# EAGLE design solarWorldClock (EAGLE 6.6.0)
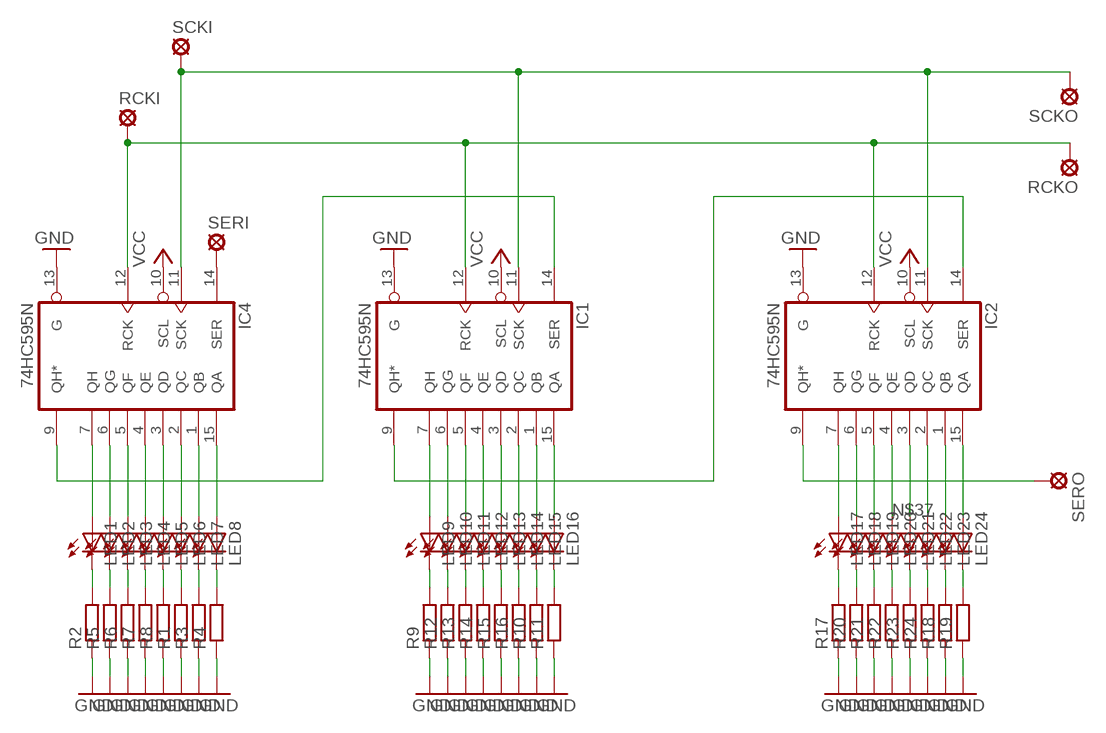
[diagram p0: schematic, sheet 1]

## Parts
IC1  74HC595N  [DIL16]
IC2  74HC595N  [DIL16]
IC4  74HC595N  [DIL16]
LED1  LEDLZR181  [LZR181]
LED2  LEDLZR181  [LZR181]
LED3  LEDLZR181  [LZR181]
LED4  LEDLZR181  [LZR181]
LED5  LEDLZR181  [LZR181]
LED6  LEDLZR181  [LZR181]
LED7  LEDLZR181  [LZR181]
LED8  LEDLZR181  [LZR181]
LED9  LEDLZR181  [LZR181]
LED10  LEDLZR181  [LZR181]
LED11  LEDLZR181  [LZR181]
LED12  LEDLZR181  [LZR181]
LED13  LEDLZR181  [LZR181]
LED14  LEDLZR181  [LZR181]
LED15  LEDLZR181  [LZR181]
LED16  LEDLZR181  [LZR181]
LED17  LEDLZR181  [LZR181]
LED18  LEDLZR181  [LZR181]
LED19  LEDLZR181  [LZR181]
LED20  LEDLZR181  [LZR181]
LED21  LEDLZR181  [LZR181]
LED22  LEDLZR181  [LZR181]
LED23  LEDLZR181  [LZR181]
LED24  LEDLZR181  [LZR181]
R1  R-EU_0207/7  [0207/7]
R2  R-EU_0207/7  [0207/7]
R3  R-EU_0207/7  [0207/7]
R4  R-EU_0207/7  [0207/7]
R5  R-EU_0207/7  [0207/7]
R6  R-EU_0207/7  [0207/7]
R7  R-EU_0207/7  [0207/7]
R8  R-EU_0207/7  [0207/7]
R9  R-EU_0207/7  [0207/7]
R10  R-EU_0207/7  [0207/7]
R11  R-EU_0207/7  [0207/7]
R12  R-EU_0207/7  [0207/7]
R13  R-EU_0207/7  [0207/7]
R14  R-EU_0207/7  [0207/7]
R15  R-EU_0207/7  [0207/7]
R16  R-EU_0207/7  [0207/7]
R17  R-EU_0207/7  [0207/7]
R18  R-EU_0207/7  [0207/7]
R19  R-EU_0207/7  [0207/7]
R20  R-EU_0207/7  [0207/7]
R21  R-EU_0207/7  [0207/7]
R22  R-EU_0207/7  [0207/7]
R23  R-EU_0207/7  [0207/7]
R24  R-EU_0207/7  [0207/7]
RCKI  LSP10  [LSP10]
RCKO  LSP10  [LSP10]
SCKI  LSP10  [LSP10]
SCKO  LSP10  [LSP10]
SERI  LSP10  [LSP10]
SERO  LSP10  [LSP10]

## Nets
GND: IC1.13(G) IC2.13(G) IC4.13(G) R1.1 R2.1 R3.1 R4.1 R5.1 R6.1 R7.1 R8.1 R9.1 R10.1 R11.1 R12.1 R13.1 R14.1 R15.1 R16.1 R17.1 R18.1 R19.1 R20.1 R21.1 R22.1 R23.1 R24.1
N$1: IC4.7(QH) LED1.A
N$2: LED1.K(C) R2.2
N$3: IC4.6(QG) LED2.A
N$4: IC4.5(QF) LED3.A
N$5: IC4.4(QE) LED4.A
N$6: IC4.3(QD) LED5.A
N$7: IC4.2(QC) LED6.A
N$8: IC4.1(QB) LED7.A
N$9: IC4.15(QA) LED8.A
N$10: LED2.K(C) R5.2
N$11: LED3.K(C) R6.2
N$12: LED4.K(C) R7.2
N$13: LED5.K(C) R8.2
N$14: LED6.K(C) R1.2
N$15: LED7.K(C) R3.2
N$16: LED8.K(C) R4.2
N$17: IC1.7(QH) LED9.A
N$18: IC1.6(QG) LED10.A
N$19: IC1.5(QF) LED11.A
N$20: IC1.4(QE) LED12.A
N$21: IC1.3(QD) LED13.A
N$22: IC1.2(QC) LED14.A
N$23: IC1.1(QB) LED15.A
N$24: IC1.15(QA) LED16.A
N$25: LED9.K(C) R9.2
N$26: LED10.K(C) R12.2
N$27: LED11.K(C) R13.2
N$28: LED12.K(C) R14.2
N$29: LED13.K(C) R15.2
N$30: LED14.K(C) R16.2
N$31: LED15.K(C) R10.2
N$32: LED16.K(C) R11.2
N$33: IC2.9(QH*) SERO.MP
N$34: IC1.14(SER) IC4.9(QH*)
N$35: IC2.7(QH) LED17.A
N$36: IC2.6(QG) LED18.A
N$37: IC2.5(QF) LED19.A
N$38: IC2.4(QE) LED20.A
N$39: IC2.3(QD) LED21.A
N$40: IC2.2(QC) LED22.A
N$41: IC2.1(QB) LED23.A
N$42: IC2.15(QA) LED24.A
N$43: LED17.K(C) R17.2
N$44: LED18.K(C) R20.2
N$45: LED19.K(C) R21.2
N$46: LED20.K(C) R22.2
N$47: LED21.K(C) R23.2
N$48: LED22.K(C) R24.2
N$49: LED23.K(C) R18.2
N$50: LED24.K(C) R19.2
N$51: IC1.9(QH*) IC2.14(SER)
N$52: IC1.12(RCK) IC2.12(RCK) IC4.12(RCK) RCKI.MP RCKO.MP
N$53: IC1.11(SCK) IC2.11(SCK) IC4.11(SCK) SCKI.MP SCKO.MP
N$54: IC4.14(SER) SERI.MP
VCC: IC1.10(SCL) IC2.10(SCL) IC4.10(SCL)

## Power pins joined to a net without a drawn wire
GND: IC1.8(GND) IC2.8(GND) IC4.8(GND)
VCC: IC1.16(VCC) IC2.16(VCC) IC4.16(VCC)

## Library data of the parts
IC1 IC2 IC4 = 74xx-eu:74*595: 8-bit SHIFT REGISTER, output latch
LED1-LED24 = led:LED: LED OSRAM: - CHIPLED LG R971, LG N971, LY N971, LG Q971, LY Q971, LO R971, LY R971 LH N974, LH R974 LS Q976, LO Q976, LY Q976 LO Q996 - Hyper CHIPLED LW Q18S LB Q993, LB Q99A, LB R99A - SideLED LS A670, LO A670, LY A670, LG A670, LP A670 LB A673, LV A673, LT A673, LW A673 LH A674 LY A675 LS A676, LA A676, LO A676, LY A676, LW A676 LS A679, LY A679, LG A679 - Hyper Micro SIDELED® LS Y876, LA Y876, LO Y876, LY Y876 LT Y87S - SmartLED LW L88C, LW L88S LB L89C, LB L89S, LG L890 LS L89K, LO L89K, LY L89K LS L896, LA L896, LO L896, LY L896 - TOPLED LS T670, LO T670, LY T670, LG T670, LP T670 LSG T670, LSP T670, LSY T670, LOP T670, LYG T670 LG T671, LOG T671, LSG T671 LB T673, LV T673, LT T673, LW T673 LH T674 LS T676, LA T676, LO T676, LY T676, LB T676, LH T676, LSB T676, LW T676 LB T67C, LV T67C, LT T67C, LS T67K, LO T67K, LY T67K, LW E67C LS E67B, LA E67B, LO E67B, LY E67B, LB E67C, LV E67C, LT E67C LW T67C LS T679, LY T679, LG T679 LS T770, LO T770, LY T770, LG T770, LP T770 LB T773, LV T773, LT T773, LW T773 LH T774 LS E675, LA E675, LY E675, LS T675 LS T776, LA T776, LO T776, LY T776, LB T776 LHGB T686 LT T68C, LB T68C - Hyper Mini TOPLED® LB M676 - Mini TOPLED Santana® LG M470 LS M47K, LO M47K, LY M47K Source: http://www.osram.convergy.de LUXEON: - LUMILED® LXK2-PW12-R00, LXK2-PW12-S00, LXK2-PW14-U00, LXK2-PW14-V00 LXK2-PM12-R00, LXK2-PM12-S00, LXK2-PM14-U00 LXK2-PE12-Q00, LXK2-PE12-R00, LXK2-PE12-S00, LXK2-PE14-T00, LXK2-PE14-U00 LXK2-PB12-K00, LXK2-PB12-L00, LXK2-PB12-M00, LXK2-PB14-N00, LXK2-PB14-P00, LXK2-PB14-Q00 LXK2-PR12-L00, LXK2-PR12-M00, LXK2-PR14-Q00, LXK2-PR14-R00 LXK2-PD12-Q00, LXK2-PD12-R00, LXK2-PD12-S00 LXK2-PH12-R00, LXK2-PH12-S00 LXK2-PL12-P00, LXK2-PL12-Q00, LXK2-PL12-R00 Source: www.luxeon.com KINGBRIGHT: KA-3528ASYC Source: www.kingbright.com
R1-R24 = rcl:R-EU_: RESISTOR, European symbol
RCKI RCKO SCKI SCKO SERI SERO = solpad:LSP10: SOLDER PAD drill 1.0 mm, distributor Buerklin, 12H555

## Board
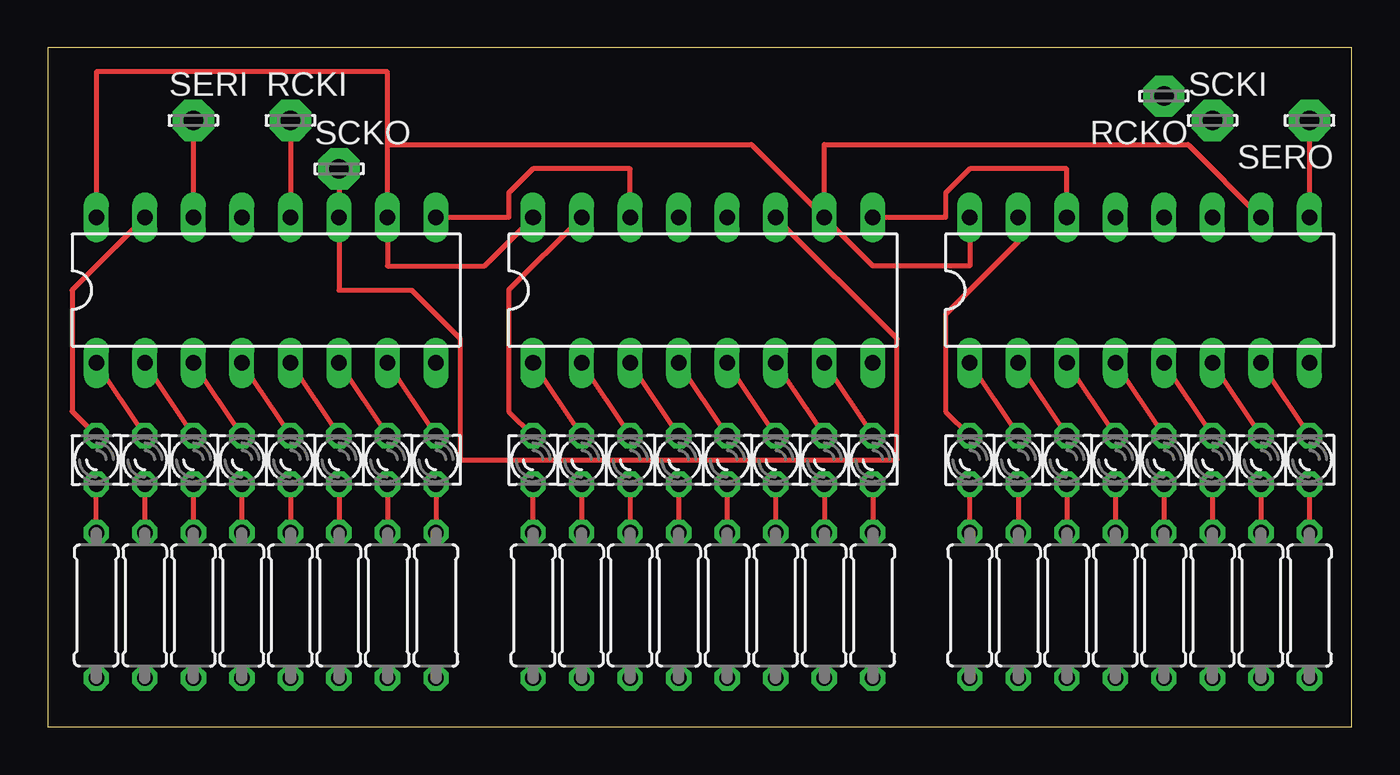
[diagram p1: board, top side]
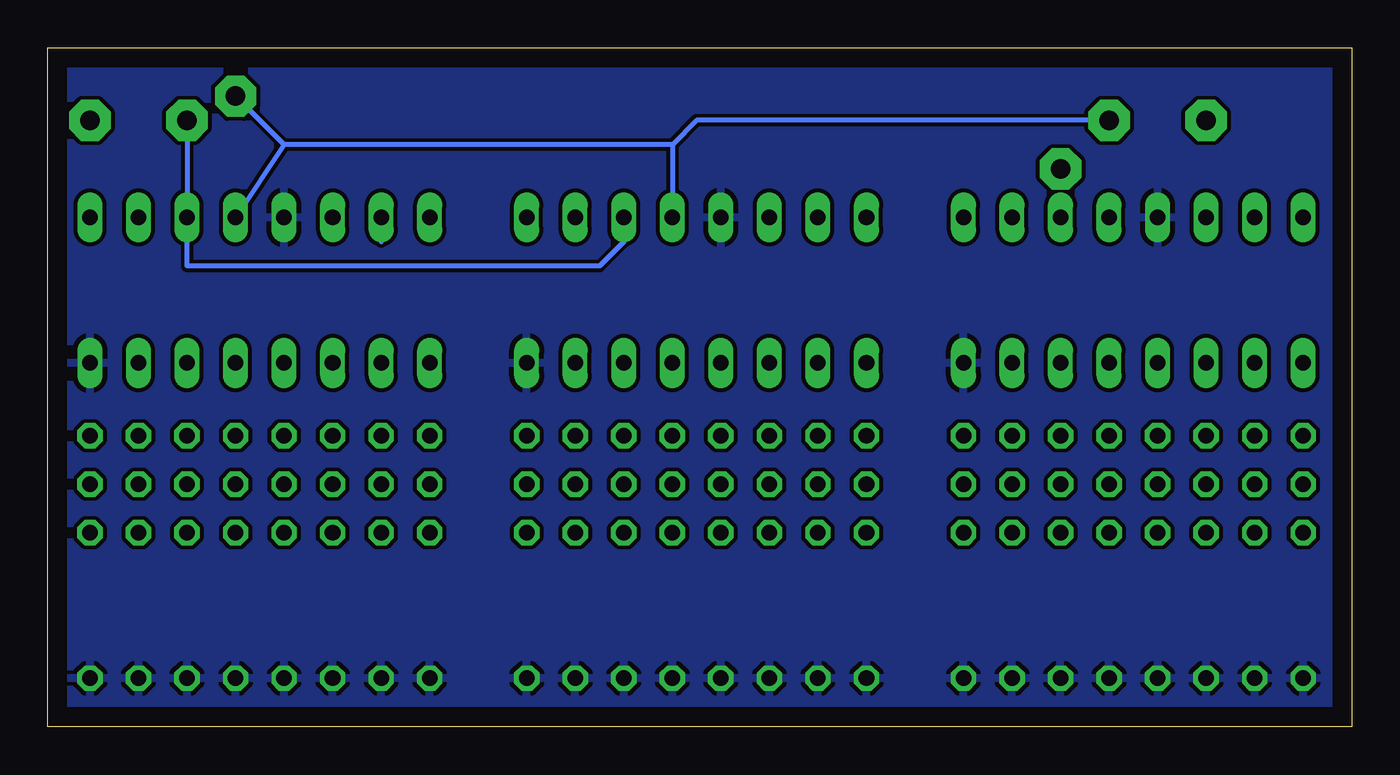
[diagram p2: board, bottom side, seen from below]

Size 68.25 x 35.55 mm. Coordinates in mm from the lower left corner, seen from the top.
Outline: 0,0 68.25,0 68.25,35.55 0,35.55 0,0
Copper layers (1*16): Top 0.035mm / dielectric 1.5mm / Bottom 0.035mm
Design rules "default": minimum track width 10mil, minimum drill 24mil, track to track 8mil, track to pad 8mil, pad to pad 8mil, via to via 8mil, smd to smd 8mil, copper to edge 40mil, drill to drill 8mil, minimum pad ring 10mil, minimum via ring 8mil, stop-mask expansion 4mil, vias tented up to drill 0mil, thermal gap 10mil

### Footprints (pad centres in the part's own frame; a part is rotated, then mirrored left to right if it is on the bottom)
DIL16 = drill 0.813 long: 1 -8.89,-3.81; 2 -6.35,-3.81; 3 -3.81,-3.81; 4 -1.27,-3.81; 5 1.27,-3.81; 6 3.81,-3.81; 7 6.35,-3.81; 8 8.89,-3.81; 9 8.89,3.81; 10 6.35,3.81; 11 3.81,3.81; 12 1.27,3.81; 13 -1.27,3.81; 14 -3.81,3.81; 15 -6.35,3.81; 16 -8.89,3.81
LZR181 = drill 0.813 octagon: A -1.27,0; K 1.27,0
0207/7 = drill 0.813 octagon: 1 -3.81,0; 2 3.81,0
LSP10 = drill 1.016 pad 2.159 octagon: MP 0,0

### Placement (x,y rotation side)
IC1  34.29,22.86 0 top
IC2  57.15,22.86 0 top
IC4  11.43,22.86 0 top
LED1  20.32,13.97 270 top
LED2  17.78,13.97 270 top
LED3  15.24,13.97 270 top
LED4  12.7,13.97 270 top
LED5  10.16,13.97 270 top
LED6  7.62,13.97 270 top
LED7  5.08,13.97 270 top
LED8  2.54,13.97 270 top
LED9  43.18,13.97 270 top
LED10  40.64,13.97 270 top
LED11  38.1,13.97 270 top
LED12  35.56,13.97 270 top
LED13  33.02,13.97 270 top
LED14  30.48,13.97 270 top
LED15  27.94,13.97 270 top
LED16  25.4,13.97 270 top
LED17  66.04,13.97 270 top
LED18  63.5,13.97 270 top
LED19  60.96,13.97 270 top
LED20  58.42,13.97 270 top
LED21  55.88,13.97 270 top
LED22  53.34,13.97 270 top
LED23  50.8,13.97 270 top
LED24  48.26,13.97 270 top
R1  7.62,6.35 90 top
R2  20.32,6.35 90 top
R3  5.08,6.35 90 top
R4  2.54,6.35 90 top
R5  17.78,6.35 90 top
R6  15.24,6.35 90 top
R7  12.7,6.35 90 top
R8  10.16,6.35 90 top
R9  43.18,6.35 90 top
R10  27.94,6.35 90 top
R11  25.4,6.35 90 top
R12  40.64,6.35 90 top
R13  38.1,6.35 90 top
R14  35.56,6.35 90 top
R15  33.02,6.35 90 top
R16  30.48,6.35 90 top
R17  66.04,6.35 90 top
R18  50.8,6.35 90 top
R19  48.26,6.35 90 top
R20  63.5,6.35 90 top
R21  60.96,6.35 90 top
R22  58.42,6.35 90 top
R23  55.88,6.35 90 top
R24  53.34,6.35 90 top
RCKI  12.7,31.75 0 top
RCKO  58.42,33.02 180 top
SCKI  60.96,31.75 0 top
SCKO  15.24,29.21 0 top
SERI  7.62,31.75 0 top
SERO  66.04,31.75 180 top

### Tracks (layer width: path | path; a pad name or v marks a point on that pad's centre or on a via)
GND
  pour Bottom: 0,35.56 0,0 68.58,0 68.58,35.56
N$1
  Top 0.254: IC4.7 LED1.A
N$2
  Top 0.254: LED1.K R2.2
N$3
  Top 0.254: IC4.6 LED2.A
N$4
  Top 0.254: IC4.5 LED3.A
N$5
  Top 0.254: IC4.4 LED4.A
N$6
  Top 0.254: IC4.3 LED5.A
N$7
  Top 0.254: IC4.2 LED6.A
N$8
  Top 0.254: IC4.1 LED7.A
N$9
  Top 0.254: LED8.A 1.27,16.51 1.27,22.86 IC4.15
N$10
  Top 0.254: LED2.K R5.2
N$11
  Top 0.254: LED3.K R6.2
N$12
  Top 0.254: LED4.K R7.2
N$13
  Top 0.254: LED5.K R8.2
N$14
  Top 0.254: LED6.K R1.2
N$15
  Top 0.254: LED7.K R3.2
N$16
  Top 0.254: R4.2 LED8.K
N$17
  Top 0.254: IC1.7 LED9.A
N$18
  Top 0.254: IC1.6 LED10.A
N$19
  Top 0.254: IC1.5 LED11.A
N$20
  Top 0.254: IC1.4 LED12.A
N$21
  Top 0.254: IC1.3 LED13.A
N$22
  Top 0.254: IC1.2 LED14.A
N$23
  Top 0.254: IC1.1 LED15.A
N$24
  Top 0.254: LED16.A 24.13,16.51 24.13,22.86 IC1.15
N$25
  Top 0.254: LED9.K R9.2
N$26
  Top 0.254: LED10.K R12.2
N$27
  Top 0.254: LED11.K R13.2
N$28
  Top 0.254: LED12.K R14.2
N$29
  Top 0.254: LED13.K R15.2
N$30
  Top 0.254: LED14.K R16.2
N$31
  Top 0.254: LED15.K R10.2
N$32
  Top 0.254: R11.2 LED16.K
N$33
  Top 0.254: SERO.MP IC2.9
N$34
  Top 0.254: IC4.9 24.13,26.67 24.13,27.94 25.4,29.21 30.48,29.21 IC1.14
N$35
  Top 0.254: IC2.7 LED17.A
N$36
  Top 0.254: IC2.6 LED18.A
N$37
  Top 0.254: IC2.5 LED19.A
N$38
  Top 0.254: IC2.4 LED20.A
N$39
  Top 0.254: IC2.3 LED21.A
N$40
  Top 0.254: IC2.2 LED22.A
N$41
  Top 0.254: IC2.1 LED23.A
N$42
  Top 0.254: LED24.A 46.99,16.51 46.99,21.59 50.8,25.4 IC2.15
  Bottom 0.254: IC2.15 50.8,25.4
N$43
  Top 0.254: LED17.K R17.2
N$44
  Top 0.254: LED18.K R20.2
N$45
  Top 0.254: LED19.K R21.2
N$46
  Top 0.254: LED20.K R22.2
N$47
  Top 0.254: LED21.K R23.2
N$48
  Top 0.254: LED22.K R24.2
N$49
  Top 0.254: LED23.K R18.2
N$50
  Top 0.254: R19.2 LED24.K
N$51
  Top 0.254: IC1.9 46.99,26.67 46.99,27.94 48.26,29.21 53.34,29.21 IC2.14
N$52
  Top 0.254: RCKI.MP IC4.12
  Bottom 0.254: RCKO.MP 55.88,30.48 | 55.88,30.48 IC2.12 | 35.56,30.48 34.29,31.75 RCKI.MP | 35.56,30.48 IC1.12 | 35.56,30.48 55.88,30.48
N$53
  Top 0.254: SCKO.MP IC4.11 15.24,22.86 19.05,22.86 21.59,20.32 21.59,13.97 44.45,13.97 44.45,20.32 IC1.11
  Bottom 0.254: SCKI.MP IC2.11 60.96,24.13 39.37,24.13 38.1,25.4 IC1.11
N$54
  Top 0.254: SERI.MP IC4.14
VCC
  Top 0.254: IC1.10 43.18,24.13 48.26,24.13 IC2.16 | IC2.10 59.69,30.48 40.64,30.48 IC1.10 | IC4.16 2.54,34.29 17.78,34.29 17.78,30.48 | 17.78,30.48 IC4.10 17.78,24.13 22.86,24.13 IC1.16 | IC1.10 36.83,30.48 17.78,30.48